# Altium schematic sheet SOURCE POWER.SchDoc
size A3; SheetNumber: 4; SheetTotal: 15
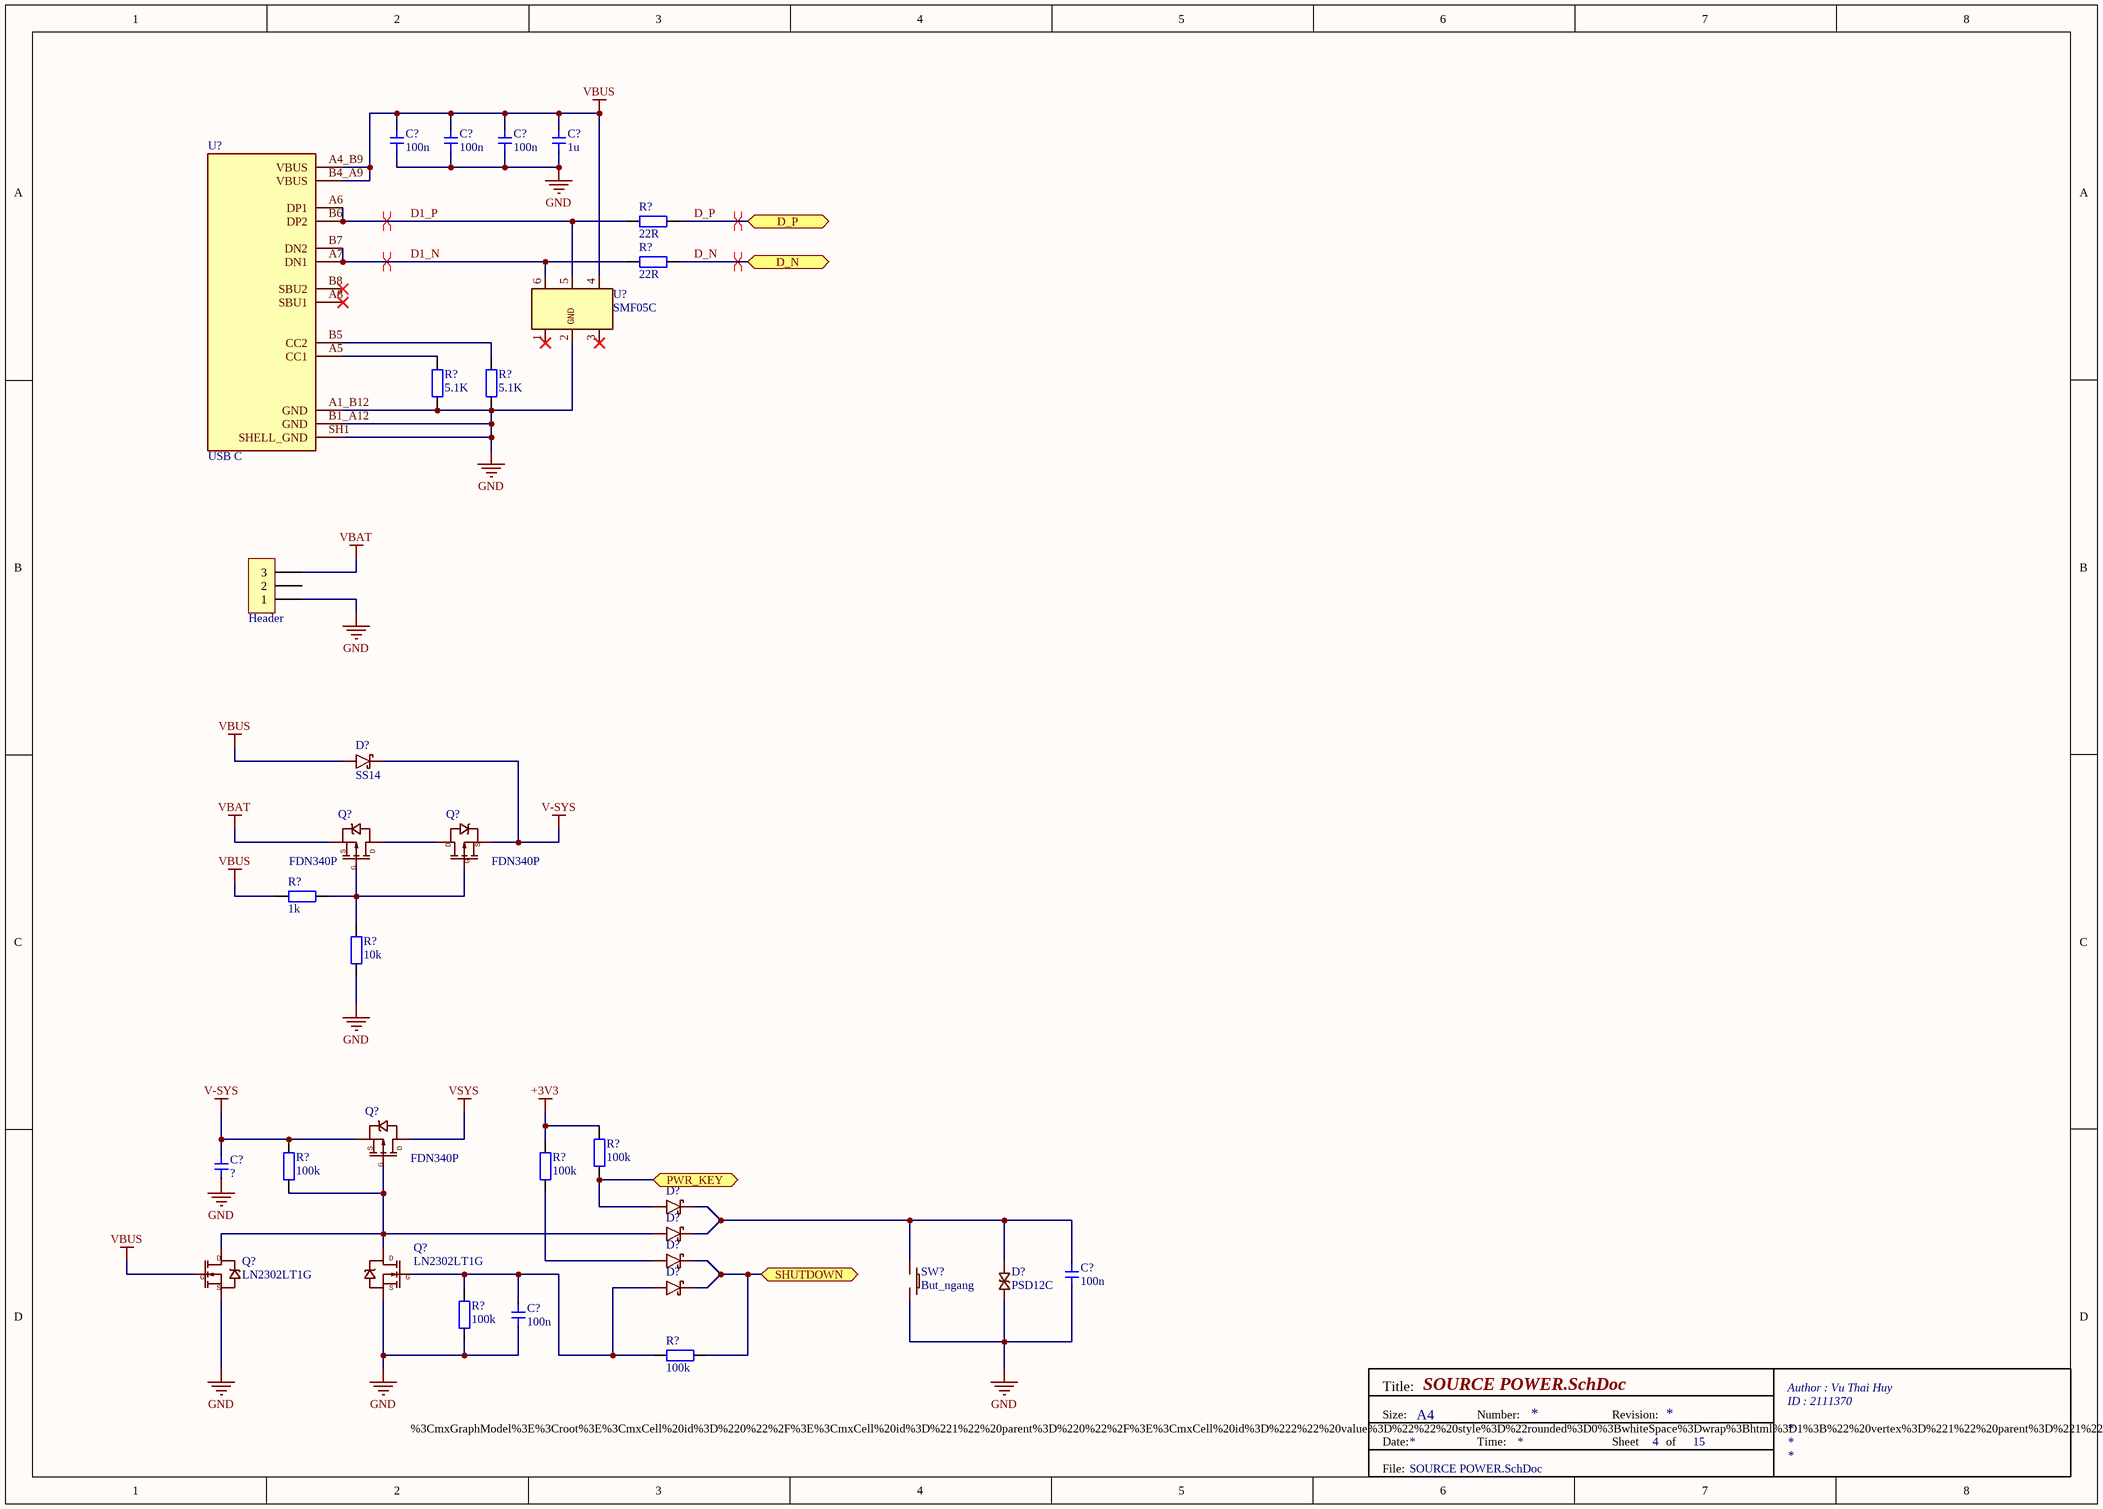
[diagram p0: SOURCE POWER.SchDoc]

## Parts
(Parts that share a designator on the sheet are numbered #1, #2 ... from top to bottom, then left to right.)
C?#1  100n  [Cap 0603]
C?#2  100n  [Cap 0603]
C?#3  100n  [Cap 0603]
C?#4  1u  [Cap 0603]
C?#5  ?  [Cap 0603]
C?#6  100n  [Cap 0603]
C?#7  100n  [Cap 0603]
D?#1  SS14  [SS14]
D?#2  1N5819W  [1N5418W]  (value not drawn)
D?#3  1N5819W  [1N5418W]  (value not drawn)
D?#4  1N5819W  [1N5418W]  (value not drawn)
D?#5  PSD12C  [SOD-323]
D?#6  1N5819W  [1N5418W]  (value not drawn)
H?  Header  [Header 3P DC 2.54]
Q?#1  FDN340P  [FDN340P]
Q?#2  FDN340P  [FDN340P]
Q?#3  FDN340P  [FDN340P]
Q?#4  LN2302LT1G  [FDN340P]
Q?#5  LN2302LT1G  [FDN340P]
R?#1  22R  [tro smd 0603]
R?#2  22R  [tro smd 0603]
R?#3  5.1K  [tro smd 0603]
R?#4  5.1K  [tro smd 0603]
R?#5  1k  [tro smd 0603]
R?#6  10k  [tro smd 0603]
R?#7  100k  [tro smd 0603]
R?#8  100k  [tro smd 0603]
R?#9  100k  [tro smd 0603]
R?#10  100k  [tro smd 0603]
R?#11  100k  [tro smd 0603]
SW?  But_ngang  [But_ngang]
U?#1  SMF05C  [SOT-363]
U?#2  USB C  [USB C]

## Ports
D_N (bidir), D_P (bidir), PWR_KEY (bidir), SHUTDOWN (bidir)

## Nets
+3V3: R?#7.2 R?#9.2
GND: C?#1.2 C?#2.2 C?#3.2 C?#4.2 C?#5.2 C?#6.2 C?#7.2 D?#5.C H?.1 Q?#4.2 Q?#5.2 R?#3.1 R?#4.1 R?#6.1 R?#10.1 SW?.2 U?#1.2(GND) U?#2.A1_B12(GND) U?#2.B1_A12(GND) U?#2.SH1(SHELL_GND)
V-SYS: C?#5.1 D?#1.2 Q?#2.2 Q?#3.2 R?#8.2
VBAT: H?.3 Q?#1.2
VBUS: C?#1.1 C?#2.1 C?#3.1 C?#4.1 D?#1.1 Q?#4.1 R?#5.1 U?#1.4(IN3) U?#2.A4_B9(VBUS) U?#2.B4_A9(VBUS)
VSYS: Q?#3.3
D1_N: R?#2.1 U?#1.6(IN4) U?#2.A7(DN1) U?#2.B7(DN2)
D1_P: R?#1.1 U?#1.5(IN4) U?#2.A6(DP1) U?#2.B6(DP2)
D_N: R?#2.2 ; port D_N
D_P: R?#1.2 ; port D_P
PWR_KEY: D?#2.A R?#7.1 ; port PWR_KEY
SHUTDOWN: D?#4.K D?#6.K R?#11.2 ; port SHUTDOWN
NetC?#6_1: C?#6.1 D?#2.K D?#3.K D?#5.A SW?.1
NetC?#7_1: C?#7.1 D?#6.A Q?#5.1 R?#10.2 R?#11.1
NetD?#3_A: D?#3.A Q?#3.1 Q?#4.3 Q?#5.3 R?#8.1
NetD?#4_A: D?#4.A R?#9.1
NetQ?#1_1: Q?#1.1 Q?#2.1 R?#5.2 R?#6.2
NetQ?#1_3: Q?#1.3 Q?#2.3
NetR?#3_2: R?#3.2 U?#2.A5(CC1)
NetR?#4_2: R?#4.2 U?#2.B5(CC2)

Not connected (* = marked no-connect by the designer): H? 2; U?#1 1(IN1)* 3(IN2)*; U?#2 A8(SBU1)* B8(SBU2)*

## Layout directives
differential pair: D1_N, D1_P, D_N, D_P

## Notes on the sheet
- Title:
- Author : Vu Thai Huy
- %3CmxGraphModel%3E%3Croot%3E%3CmxCell%20id%3D%220%22%2F%3E%3CmxCell%20id%3D%221%22%20parent%3D%220%22%2F%3E%3CmxCell%20id%3D%222%22%20value%3D%22%22%20style%3D%22rounded%3D0%3BwhiteSpace%3Dwrap%3Bhtml%3D1%3B%22%20vertex%3D%221%22%20parent%3D%221%22%3E%3CmxGeometry%20x%3D%22360%22%20y%3D%22320%22%20width%3D%22200%22%20height%3D%22320%22%20as%3D%22geometry%22%2F%3E%3C%2FmxCell%3E%3CmxCell%20id%3D%223%22%20value%3D%22USB%20Type%20C%22%20style%3D%22rounded%3D0%3BwhiteSpace%3Dwrap%3Bhtml%3D1%3B%22%20vertex%3D%221%22%20parent%3D%221%22%3E%3CmxGeometry%20x%3D%22640%22%20y%3D%22519.68%22%20width%3D%22120%22%20height%3D%2240%22%20as%3D%22geometry%22%2F%3E%3C%2FmxCell%3E%3CmxCell%20id%3D%224%22%20value%3D%22A%2FD%20Converter%2016%20bit%22%20style%3D%22rounded%3D0%3BwhiteSpace%3Dwrap%3Bhtml%3D1%3Brotation%3D90%3B%22%20vertex%3D%221%22%20parent%3D%221%22%3E%3CmxGeometry%20x%3D%22141.09%22%20y%3D%22380.16%22%20width%3D%22199.07%22%20height%3D%2279.37%22%20as%3D%22geometry%22%2F%3E%3C%2FmxCell%3E%3CmxCell%20id%3D%225%22%20style%3D%22edgeStyle%3DorthogonalEdgeStyle%3Brounded%3D0%3BorthogonalLoop%3D1%3BjettySize%3Dauto%3Bhtml%3D1%3BexitX%3D0.5%3BexitY%3D0%3BexitDx%3D0%3BexitDy%3D0%3B%22%20edge%3D%221%22%20parent%3D%221%22%3E%3CmxGeometry%20relative%3D%221%22%20as%3D%22geometry%22%3E%3CmxPoint%20x%3D%22200%22%20y%3D%22329.9233333333334%22%20as%3D%22targetPoint%22%2F%3E%3CmxPoint%20x%3D%22120%22%20y%3D%22329.59000000000003%22%20as%3D%22sourcePoint%22%2F%3E%3C%2FmxGeometry%3E%3C%2FmxCell%3E%3CmxCell%20id%3D%226%22%20value%3D%22Shift%20Logic%20Input%26amp%3Bnbsp%3B%26lt%3Bbr%26gt%3BDigital%22%20style%3D%22rounded%3D0%3BwhiteSpace%3Dwrap%3Bhtml%3D1%3Brotation%3D90%3B%22%20vertex%3D%221%22%20parent%3D%221%22%3E%3CmxGeometry%20x%3D%22190.31%22%20y%3D%22550.94%22%20width%3D%22100%22%20height%3D%2278.75%22%20as%3D%22geometry%22%2F%3E%3C%2FmxCell%3E%3CmxCell%20id%3D%227%22%20value%3D%228%20Chanel%20Digital%20Input%22%20style%3D%22rounded%3D0%3BwhiteSpace%3Dwrap%3Bhtml%3D1%3Brotation%3D0%3B%22%20vertex%3D%221%22%20parent%3D%221%22%3E%3CmxGeometry%20x%3D%227.105427357601002e-15%22%20y%3D%22570.32%22%20width%3D%22120%22%20height%3D%2240%22%20as%3D%22geometry%22%2F%3E%3C%2FmxCell%3E%3CmxCell%20id%3D%228%22%20value%3D%22GPS%22%20style%3D%22rounded%3D0%3BwhiteSpace%3Dwrap%3Bhtml%3D1%3B%22%20vertex%3D%221%22%20parent%3D%221%22%3E%3CmxGeometry%20x%3D%22640%22%20y%3D%22455%22%20width%3D%22120%22%20height%3D%2240%22%20as%3D%22geometry%22%2F%3E%3C%2FmxCell%3E%3CmxCell%20id%3D%229%22%20value%3D%22Micro%20SD%20Card%22%20style%3D%22rounded%3D0%3BwhiteSpace%3Dwrap%3Bhtml%3D1%3B%22%20vertex%3D%221%22%20parent%3D%221%22%3E%3CmxGeometry%20x%3D%22640%22%20y%3D%22320%22%20width%3D%22120%22%20height%3D%2240%22%20as%3D%22geometry%22%2F%3E%3C%2FmxCell%3E%3CmxCell%20id%3D%2210%22%20value%3D%22RTC%22%20style%3D%22rounded%3D0%3BwhiteSpace%3Dwrap%3Bhtml%3D1%3B%22%20vertex%3D%221%22%20parent%3D%221%22%3E%3CmxGeometry%20x%3D%22640%22%20y%3D%22390%22%20width%3D%22120%22%20height%3D%2240%22%20as%3D%22geometry%22%2F%3E%3C%2FmxCell%3E%3CmxCell%20id%3D%2211%22%20value%3D%22%22%20style%3D%22endArrow%3Dclassic%3BstartArrow%3Dclassic%3Bhtml%3D1%3Brounded%3D0%3BentryX%3D0%3BentryY%3D0.25%3BentryDx%3D0%3BentryDy%3D0%3B%22%20edge%3D%221%22%20parent%3D%221%22%3E%3CmxGeometry%20width%3D%2250%22%20height%3D%2250%22%20relative%3D%221%22%20as%3D%22geometry%22%3E%3CmxPoint%20x%3D%22280%22%20y%3D%22430%22%20as%3D%22sourcePoint%22%2F%3E%3CmxPoint%20x%3D%22360%22%20y%3D%22430%22%20as%3D%22targetPoint%22%2F%3E%3C%2FmxGeometry%3E%3C%2FmxCell%3E%3CmxCell%20id%3D%2212%22%20value%3D%22%22%20style%3D%22endArrow%3Dclassic%3BstartArrow%3Dclassic%3Bhtml%3D1%3Brounded%3D0%3BentryX%3D0%3BentryY%3D0.25%3BentryDx%3D0%3BentryDy%3D0%3B%22%20edge%3D%221%22%20parent%3D%221%22%3E%3CmxGeometry%20width%3D%2250%22%20height%3D%2250%22%20relative%3D%221%22%20as%3D%22geometry%22%3E%3CmxPoint%20x%3D%22280%22%20y%3D%22570%22%20as%3D%22sourcePoint%22%2F%3E%3CmxPoint%20x%3D%22360%22%20y%3D%22570%22%20as%3D%22targetPoint%22%2F%3E%3C%2FmxGeometry%3E%3C%2FmxCell%3E%3CmxCell%20id%3D%2213%22%20value%3D%22%22%20style%3D%22endArrow%3Dclassic%3BstartArrow%3Dclassic%3Bhtml%3D1%3Brounded%3D0%3BentryX%3D0%3BentryY%3D0.25%3BentryDx%3D0%3BentryDy%3D0%3B%22%20edge%3D%221%22%20parent%3D%221%22%3E%3CmxGeometry%20width%3D%2250%22%20height%3D%2250%22%20relative%3D%221%22%20as%3D%22geometry%22%3E%3CmxPoint%20x%3D%22120%22%20y%3D%22590.08%22%20as%3D%22sourcePoint%22%2F%3E%3CmxPoint%20x%3D%22200%22%20y%3D%22590.08%22%20as%3D%22targetPoint%22%2F%3E%3C%2FmxGeometry%3E%3C%2FmxCell%3E%3CmxCell%20id%3D%2214%22%20value%3D%22%22%20style%3D%22endArrow%3Dclassic%3BstartArrow%3Dclassic%3Bhtml%3D1%3Brounded%3D0%3BentryX%3D0%3BentryY%3D0.25%3BentryDx%3D0%3BentryDy%3D0%3B%22%20edge%3D%221%22%20parent%3D%221%22%3E%3CmxGeometry%20width%3D%2250%22%20height%3D%2250%22%20relative%3D%221%22%20as%3D%22geometry%22%3E%3CmxPoint%20x%3D%22560%22%20y%3D%22539.38%22%20as%3D%22sourcePoint%22%2F%3E%3CmxPoint%20x%3D%22640%22%20y%3D%22539.38%22%20as%3D%22targetPoint%22%2F%3E%3C%2FmxGeometry%3E%3C%2FmxCell%3E%3CmxCell%20id%3D%2215%22%20value%3D%22%22%20style%3D%22endArrow%3Dclassic%3BstartArrow%3Dclassic%3Bhtml%3D1%3Brounded%3D0%3BentryX%3D0%3BentryY%3D0.25%3BentryDx%3D0%3BentryDy%3D0%3B%22%20edge%3D%221%22%20parent%3D%221%22%3E%3CmxGeometry%20width%3D%2250%22%20height%3D%2250%22%20relative%3D%221%22%20as%3D%22geometry%22%3E%3CmxPoint%20x%3D%22560%22%20y%3D%22474.5799999999999%22%20as%3D%22sourcePoint%22%2F%3E%3CmxPoint%20x%3D%22640%22%20y%3D%22474.5799999999999%22%20as%3D%22targetPoint%22%2F%3E%3C%2FmxGeometry%3E%3C%2FmxCell%3E%3CmxCell%20id%3D%2216%22%20value%3D%22%22%20style%3D%22endArrow%3Dclassic%3BstartArrow%3Dclassic%3Bhtml%3D1%3Brounded%3D0%3BentryX%3D0%3BentryY%3D0.25%3BentryDx%3D0%3BentryDy%3D0%3B%22%20edge%3D%221%22%20parent%3D%221%22%3E%3CmxGeometry%20width%3D%2250%22%20height%3D%2250%22%20relative%3D%221%22%20as%3D%22geometry%22%3E%3CmxPoint%20x%3D%22560%22%20y%3D%22339.58%22%20as%3D%22sourcePoint%22%2F%3E%3CmxPoint%20x%3D%22640%22%20y%3D%22339.58%22%20as%3D%22targetPoint%22%2F%3E%3C%2FmxGeometry%3E%3C%2FmxCell%3E%3CmxCell%20id%3D%2217%22%20value%3D%22%22%20style%3D%22endArrow%3Dclassic%3BstartArrow%3Dclassic%3Bhtml%3D1%3Brounded%3D0%3BentryX%3D0%3BentryY%3D0.25%3BentryDx%3D0%3BentryDy%3D0%3B%22%20edge%3D%221%22%20parent%3D%221%22%3E%3CmxGeometry%20width%3D%2250%22%20height%3D%2250%22%20relative%3D%221%22%20as%3D%22geometry%22%3E%3CmxPoint%20x%3D%22560%22%20y%3D%22409.58%22%20as%3D%22sourcePoint%22%2F%3E%3CmxPoint%20x%3D%22640%22%20y%3D%22409.58%22%20as%3D%22targetPoint%22%2F%3E%3C%2FmxGeometry%3E%3C%2FmxCell%3E%3CmxCell%20id%3D%2218%22%20value%3D%22ESP32-C3-WROOM-U2%22%20style%3D%22rounded%3D0%3BwhiteSpace%3Dwrap%3Bhtml%3D1%3B%22%20vertex%3D%221%22%20parent%3D%221%22%3E%3CmxGeometry%20x%3D%22245%22%20y%3D%22160%22%20width%3D%22180%22%20height%3D%2280%22%20as%3D%22geometry%22%2F%3E%3C%2FmxCell%3E%3CmxCell%20id%3D%2219%22%20value%3D%22%22%20style%3D%22endArrow%3Dclassic%3BstartArrow%3Dclassic%3Bhtml%3D1%3Brounded%3D0%3BentryX%3D0.75%3BentryY%3D1%3BentryDx%3D0%3BentryDy%3D0%3BexitX%3D0.322%3BexitY%3D-0.005%3BexitDx%3D0%3BexitDy%3D0%3BexitPerimeter%3D0%3B%22%20edge%3D%221%22%20source%3D%2227%22%20target%3D%2218%22%20parent%3D%221%22%3E%3CmxGeometry%20width%3D%2250%22%20height%3D%2250%22%20relative%3D%221%22%20as%3D%22geometry%22%3E%3CmxPoint%20x%3D%22370%22%20y%3D%22430%22%20as%3D%22sourcePoint%22%2F%3E%3CmxPoint%20x%3D%22420%22%20y%3D%22380%22%20as%3D%22targetPoint%22%2F%3E%3C%2FmxGeometry%3E%3C%2FmxCell%3E%3CmxCell%20id%3D%2220%22%20value%3D%22MAX485%22%20style%3D%22rounded%3D0%3BwhiteSpace%3Dwrap%3Bhtml%3D1%3Brotation%3D0%3B%22%20vertex%3D%221%22%20parent%3D%221%22%3E%3CmxGeometry%20x%3D%22200.46999999999994%22%20y%3D%22680%22%20width%3D%2279.69%22%20height%3D%2280%22%20as%3D%22geometry%22%2F%3E%3C%2FmxCell%3E%3CmxCell%20id%3D%2221%22%20value%3D%22RS485%22%20style%3D%22rounded%3D0%3BwhiteSpace%3Dwrap%3Bhtml%3D1%3Brotation%3D0%3B%22%20vertex%3D%221%22%20parent%3D%221%22%3E%3CmxGeometry%20y%3D%22680%22%20width%3D%22159.38%22%20height%3D%2280%22%20as%3D%22geometry%22%2F%3E%3C%2FmxCell%3E%3CmxCell%20id%3D%2222%22%20value%3D%22%22%20style%3D%22endArrow%3Dclassic%3BstartArrow%3Dclassic%3Bhtml%3D1%3Brounded%3D0%3BentryX%3D0%3BentryY%3D0.5%3BentryDx%3D0%3BentryDy%3D0%3BexitX%3D1%3BexitY%3D0.5%3BexitDx%3D0%3BexitDy%3D0%3B%22%20edge%3D%221%22%20source%3D%2221%22%20target%3D%2220%22%20parent%3D%221%22%3E%3CmxGeometry%20width%3D%2250%22%20height%3D%2250%22%20relative%3D%221%22%20as%3D%22geometry%22%3E%3CmxPoint%20x%3D%22260%22%20y%3D%22719.6300000000001%22%20as%3D%22sourcePoint%22%2F%3E%3CmxPoint%20x%3D%22340%22%20y%3D%22719.6300000000001%22%20as%3D%22targetPoint%22%2F%3E%3C%2FmxGeometry%3E%3C%2FmxCell%3E%3CmxCell%20id%3D%2223%22%20value%3D%22%22%20style%3D%22endArrow%3Dclassic%3BstartArrow%3Dclassic%3Bhtml%3D1%3Brounded%3D0%3BentryX%3D0.5%3BentryY%3D1%3BentryDx%3D0%3BentryDy%3D0%3B%22%20edge%3D%221%22%20parent%3D%221%22%3E%3CmxGeometry%20width%3D%2250%22%20height%3D%2250%22%20relative%3D%221%22%20as%3D%22geometry%22%3E%3CmxPoint%20x%3D%22390.43000000000006%22%20y%3D%22680%22%20as%3D%22sourcePoint%22%2F%3E%3CmxPoint%20x%3D%22390%22%20y%3D%22640%22%20as%3D%22targetPoint%22%2F%3E%3C%2FmxGeometry%3E%3C%2FmxCell%3E%3CmxCell%20id%3D%2224%22%20value%3D%22Button%26lt%3Bdiv%26gt%3BEvent%26lt%3B%2Fdiv%26gt%3B%22%20style%3D%22rounded%3D0%3BwhiteSpace%3Dwrap%3Bhtml%3D1%3Brotation%3D0%3B%22%20vertex%3D%221%22%20parent%3D%221%22%3E%3CmxGeometry%20x%3D%22480%22%20y%3D%22680%22%20width%3D%2290%22%20height%3D%2280%22%20as%3D%22geometry%22%2F%3E%3C%2FmxCell%3E%3CmxCell%20id%3D%2225%22%20value%3D%22%22%20style%3D%22endArrow%3Dclassic%3BstartArrow%3Dclassic%3Bhtml%3D1%3Brounded%3D0%3BentryX%3D0.5%3BentryY%3D1%3BentryDx%3D0%3BentryDy%3D0%3B%22%20edge%3D%221%22%20parent%3D%221%22%3E%3CmxGeometry%20width%3D%2250%22%20height%3D%2250%22%20relative%3D%221%22%20as%3D%22geometry%22%3E%3CmxPoint%20x%3D%22520.4300000000001%22%20y%3D%22680%22%20as%3D%22sourcePoint%22%2F%3E%3CmxPoint%20x%3D%22520%22%20y%3D%22640%22%20as%3D%22targetPoint%22%2F%3E%3C%2FmxGeometry%3E%3C%2FmxCell%3E%3CmxCell%20id%3D%2226%22%20value%3D%22I2C1%22%20style%3D%22rounded%3D0%3BwhiteSpace%3Dwrap%3Bhtml%3D1%3B%22%20vertex%3D%221%22%20parent%3D%221%22%3E%3CmxGeometry%20x%3D%22360%22%20y%3D%22370%22%20width%3D%2250%22%20height%3D%22110%22%20as%3D%22geometry%22%2F%3E%3C%2FmxCell%3E%3CmxCell%20id%3D%2227%22%20value%3D%22UART1%22%20style%3D%22rounded%3D0%3BwhiteSpace%3Dwrap%3Bhtml%3D1%3B%22%20vertex%3D%221%22%20parent%3D%221%22%3E%3CmxGeometry%20x%3D%22360%22%20y%3D%22320%22%20width%3D%2260%22%20height%3D%2250%22%20as%3D%22geometry%22%2F%3E%3C%2FmxCell%3E%3CmxCell%20id%3D%2228%22%20value%3D%22SPI1%22%20style%3D%22rounded%3D0%3BwhiteSpace%3Dwrap%3Bhtml%3D1%3B%22%20vertex%3D%221%22%20parent%3D%221%22%3E%3CmxGeometry%20x%3D%22490%22%20y%3D%22320%22%20width%3D%2270%22%20height%3D%2250%22%20as%3D%22geometry%22%2F%3E%3C%2FmxCell%3E%3CmxCell%20id%3D%2229%22%20value%3D%22I2C1%22%20style%3D%22rounded%3D0%3BwhiteSpace%3Dwrap%3Bhtml%3D1%3B%22%20vertex%3D%221%22%20parent%3D%221%22%3E%3CmxGeometry%20x%3D%22490%22%20y%3D%22370%22%20width%3D%2270%22%20height%3D%2280%22%20as%3D%22geometry%22%2F%3E%3C%2FmxCell%3E%3CmxCell%20id%3D%2230%22%20value%3D%22UART2%22%20style%3D%22rounded%3D0%3BwhiteSpace%3Dwrap%3Bhtml%3D1%3B%22%20vertex%3D%221%22%20parent%3D%221%22%3E%3CmxGeometry%20x%3D%22490%22%20y%3D%22450%22%20width%3D%2270%22%20height%3D%2250%22%20as%3D%22geometry%22%2F%3E%3C%2FmxCell%3E%3CmxCell%20id%3D%2231%22%20value%3D%22USB%22%20style%3D%22rounded%3D0%3BwhiteSpace%3Dwrap%3Bhtml%3D1%3B%22%20vertex%3D%221%22%20parent%3D%221%22%3E%3CmxGeometry%20x%3D%22490%22%20y%3D%22500%22%20width%3D%2270%22%20height%3D%22100%22%20as%3D%22geometry%22%2F%3E%3C%2FmxCell%3E%3CmxCell%20id%3D%2232%22%20style%3D%22edgeStyle%3DorthogonalEdgeStyle%3Brounded%3D0%3BorthogonalLoop%3D1%3BjettySize%3Dauto%3Bhtml%3D1%3BexitX%3D1%3BexitY%3D0.5%3BexitDx%3D0%3BexitDy%3D0%3BentryX%3D0%3BentryY%3D0.5%3BentryDx%3D0%3BentryDy%3D0%3B%22%20edge%3D%221%22%20source%3D%2233%22%20target%3D%2236%22%20parent%3D%221%22%3E%3CmxGeometry%20relative%3D%221%22%20as%3D%22geometry%22%2F%3E%3C%2FmxCell%3E%3CmxCell%20id%3D%2233%22%20value%3D%22xGPIO%22%20style%3D%22rounded%3D0%3BwhiteSpace%3Dwrap%3Bhtml%3D1%3B%22%20vertex%3D%221%22%20parent%3D%221%22%3E%3CmxGeometry%20x%3D%22450%22%20y%3D%22600%22%20width%3D%22110%22%20height%3D%2240%22%20as%3D%22geometry%22%2F%3E%3C%2FmxCell%3E%3CmxCell%20id%3D%2234%22%20value%3D%22UART3%22%20style%3D%22rounded%3D0%3BwhiteSpace%3Dwrap%3Bhtml%3D1%3B%22%20vertex%3D%221%22%20parent%3D%221%22%3E%3CmxGeometry%20x%3D%22360%22%20y%3D%22600%22%20width%3D%2290%22%20height%3D%2240%22%20as%3D%22geometry%22%2F%3E%3C%2FmxCell%3E%3CmxCell%20id%3D%2235%22%20value%3D%22xGPIO%22%20style%3D%22rounded%3D0%3BwhiteSpace%3Dwrap%3Bhtml%3D1%3B%22%20vertex%3D%221%22%20parent%3D%221%22%3E%3CmxGeometry%20x%3D%22360%22%20y%3D%22480%22%20width%3D%2250%22%20height%3D%22119.37%22%20as%3D%22geometry%22%2F%3E%3C%2FmxCell%3E%3CmxCell%20id%3D%2236%22%20value%3D%22LED%22%20style%3D%22rounded%3D0%3BwhiteSpace%3Dwrap%3Bhtml%3D1%3B%22%20vertex%3D%221%22%20parent%3D%221%22%3E%3CmxGeometry%20x%3D%22640%22%20y%3D%22599.37%22%20width%3D%22120%22%20height%3D%2240%22%20as%3D%22geometry%22%2F%3E%3C%2FmxCell%3E%3CmxCell%20id%3D%2237%22%20value%3D%223Ch%204-20mA-%26amp%3Bgt%3B1-5V%22%20style%3D%22rounded%3D0%3BwhiteSpace%3Dwrap%3Bhtml%3D1%3B%22%20vertex%3D%221%22%20parent%3D%221%22%3E%3CmxGeometry%20y%3D%22310%22%20width%3D%22120%22%20height%3D%2240%22%20as%3D%22geometry%22%2F%3E%3C%2FmxCell%3E%3CmxCell%20id%3D%2238%22%20value%3D%222Ch%200-10V-%26amp%3Bgt%3B0-5V%22%20style%3D%22rounded%3D0%3BwhiteSpace%3Dwrap%3Bhtml%3D1%3B%22%20vertex%3D%221%22%20parent%3D%221%22%3E%3CmxGeometry%20y%3D%22370%22%20width%3D%22120%22%20height%3D%2240%22%20as%3D%22geometry%22%2F%3E%3C%2FmxCell%3E%3CmxCell%20id%3D%2239%22%20value%3D%222Ch%200-5V%22%20style%3D%22rounded%3D0%3BwhiteSpace%3Dwrap%3Bhtml%3D1%3B%22%20vertex%3D%221%22%20parent%3D%221%22%3E%3CmxGeometry%20y%3D%22430%22%20width%3D%22120%22%20height%3D%2240%22%20as%3D%22geometry%22%2F%3E%3C%2FmxCell%3E%3CmxCell%20id%3D%2240%22%20value%3D%221Ch%200-100mV-%26amp%3Bgt%3B0-5V%22%20style%3D%22rounded%3D0%3BwhiteSpace%3Dwrap%3Bhtml%3D1%3Brotation%3D0%3B%22%20vertex%3D%221%22%20parent%3D%221%22%3E%3CmxGeometry%20x%3D%227.105427357601002e-15%22%20y%3D%22490%22%20width%3D%22120%22%20height%3D%2240%22%20as%3D%22geometry%22%2F%3E%3C%2FmxCell%3E%3CmxCell%20id%3D%2241%22%20style%3D%22edgeStyle%3DorthogonalEdgeStyle%3Brounded%3D0%3BorthogonalLoop%3D1%3BjettySize%3Dauto%3Bhtml%3D1%3BexitX%3D1%3BexitY%3D0.5%3BexitDx%3D0%3BexitDy%3D0%3BentryX%3D0.35%3BentryY%3D1.012%3BentryDx%3D0%3BentryDy%3D0%3BentryPerimeter%3D0%3B%22%20edge%3D%221%22%20source%3D%2238%22%20target%3D%224%22%20parent%3D%221%22%3E%3CmxGeometry%20relative%3D%221%22%20as%3D%22geometry%22%2F%3E%3C%2FmxCell%3E%3CmxCell%20id%3D%2242%22%20style%3D%22edgeStyle%3DorthogonalEdgeStyle%3Brounded%3D0%3BorthogonalLoop%3D1%3BjettySize%3Dauto%3Bhtml%3D1%3BexitX%3D1%3BexitY%3D0.5%3BexitDx%3D0%3BexitDy%3D0%3BentryX%3D0.647%3BentryY%3D0.99%3BentryDx%3D0%3BentryDy%3D0%3BentryPerimeter%3D0%3B%22%20edge%3D%221%22%20source%3D%2239%22%20target%3D%224%22%20parent%3D%221%22%3E%3CmxGeometry%20relative%3D%221%22%20as%3D%22geometry%22%2F%3E%3C%2FmxCell%3E%3CmxCell%20id%3D%2243%22%20style%3D%22edgeStyle%3DorthogonalEdgeStyle%3Brounded%3D0%3BorthogonalLoop%3D1%3BjettySize%3Dauto%3Bhtml%3D1%3BexitX%3D1%3BexitY%3D0.5%3BexitDx%3D0%3BexitDy%3D0%3BentryX%3D0.954%3BentryY%3D0.998%3BentryDx%3D0%3BentryDy%3D0%3BentryPerimeter%3D0%3B%22%20edge%3D%221%22%20source%3D%2240%22%20target%3D%224%22%20parent%3D%221%22%3E%3CmxGeometry%20relative%3D%221%22%20as%3D%22geometry%22%2F%3E%3C%2FmxCell%3E%3CmxCell%20id%3D%2244%22%20value%3D%22CH340G%22%20style%3D%22rounded%3D0%3BwhiteSpace%3Dwrap%3Bhtml%3D1%3Brotation%3D0%3B%22%20vertex%3D%221%22%20parent%3D%221%22%3E%3CmxGeometry%20x%3D%22349.99999999999994%22%20y%3D%22680%22%20width%3D%2279.69%22%20height%3D%2280%22%20as%3D%22geometry%22%2F%3E%3C%2FmxCell%3E%3CmxCell%20id%3D%2245%22%20value%3D%22%22%20style%3D%22endArrow%3Dclassic%3BstartArrow%3Dclassic%3Bhtml%3D1%3Brounded%3D0%3B%22%20edge%3D%221%22%20parent%3D%221%22%3E%3CmxGeometry%20width%3D%2250%22%20height%3D%2250%22%20relative%3D%221%22%20as%3D%22geometry%22%3E%3CmxPoint%20x%3D%22280%22%20y%3D%22719.66%22%20as%3D%22sourcePoint%22%2F%3E%3CmxPoint%20x%3D%22350%22%20y%3D%22720%22%20as%3D%22targetPoint%22%2F%3E%3C%2FmxGeometry%3E%3C%2FmxCell%3E%3CmxCell%20id%3D%2246%22%20value%3D%22LCD%20TFT%22%20style%3D%22rounded%3D0%3BwhiteSpace%3Dwrap%3Bhtml%3D1%3B%22%20vertex%3D%221%22%20parent%3D%221%22%3E%3CmxGeometry%20x%3D%22450%22%20y%3D%22160%22%20width%3D%22120%22%20height%3D%2280%22%20as%3D%22geometry%22%2F%3E%3C%2FmxCell%3E%3CmxCell%20id%3D%2247%22%20value%3D%22%22%20style%3D%22endArrow%3Dclassic%3BstartArrow%3Dclassic%3Bhtml%3D1%3Brounded%3D0%3BentryX%3D0.25%3BentryY%3D1%3BentryDx%3D0%3BentryDy%3D0%3B%22%20edge%3D%221%22%20target%3D%2246%22%20parent%3D%221%22%3E%3CmxGeometry%20width%3D%2250%22%20height%3D%2250%22%20relative%3D%221%22%20as%3D%22geometry%22%3E%3CmxPoint%20x%3D%22480%22%20y%3D%22320%22%20as%3D%22sourcePoint%22%2F%3E%3CmxPoint%20x%3D%22530%22%20y%3D%22270%22%20as%3D%22targetPoint%22%2F%3E%3C%2FmxGeometry%3E%3C%2FmxCell%3E%3CmxCell%20id%3D%2248%22%20value%3D%22SPI2%22%20style%3D%22rounded%3D0%3BwhiteSpace%3Dwrap%3Bhtml%3D1%3B%22%20vertex%3D%221%22%20parent%3D%221%22%3E%3CmxGeometry%20x%3D%22420%22%20y%3D%22320%22%20width%3D%2270%22%20height%3D%2250%22%20as%3D%22geometry%22%2F%3E%3C%2FmxCell%3E%3C%2Froot%3E%3C%2FmxGraphModel%3E
- Size:
- Date:
- A4
- Number:
- Time:
- Revision:
- Sheet
- of
- ID : 2111370
- File:
- (in symbol FDN340P) S; D; G
- (in symbol LN2302LT1G) D; G; S

## Library data of the parts
C?#1-C?#7 = Cap 0603: Capacitor SMD 0603
D?#2-D?#4 D?#6 = 1N5819W: https://www.thegioiic.com/1n5819w-diode-schottky-1a-40v-sod-123
D?#5 = PSD12C: Package SOD323, Diode TVS, 50 pF, 29.5 V
H? = Header 3P 2.54 Duc Cong: Cắm; Ten_Linh_Kien: Header 3P XH2.54-3P Đực Cong; Don_Vi: Con; Ma_Hang: MH001302; Chung_Loai: Cắm
R?#1 R?#2 = Tro 0603 1% 0R: Dán; Don_Vi: Con; So_Chan: 2; Ten_Linh_Kien: Trở 0603 1% 0R; Ma_Hang: MH005792; Chung_Loai: Dán; Kieu_Chan: *
R?#3 R?#4 = Tro 0603 1% 4.3 k: Dán; Don_Vi: Con; So_Chan: 2; Ten_Linh_Kien: Trở 0603 1% 4.3k; Ma_Hang: MH008715; Chung_Loai: Dán; Kieu_Chan: *
R?#5 = Tro 0603 1% 1k: Dán; So_Chan: 2; Don_Vi: Con; Ten_Linh_Kien: Trở 0603 1% 1k; Ma_Hang: MH006334; Chung_Loai: Dán; Kieu_Chan: *
R?#6-R?#11 = Tro 0603 1% 10k: Dán; Don_Vi: Con; So_Chan: 2; Ten_Linh_Kien: Trở 0603 1% 10k; Ma_Hang: MH006333; Chung_Loai: Dán; Kieu_Chan: *
SW? = But_ngang: https://www.thegioiic.com/nut-nhan-3x6mm-cao-3-5mm-4-chan-smd-chinh-ngang
U?#1 = SMF05C: https://www.thegioiic.com/products?search=smf05
U?#2 = USB TYPE C 16PIN: https://www.thegioiic.com/cong-usb-cai-3-1-type-c-16-chan-thang-dan-smd